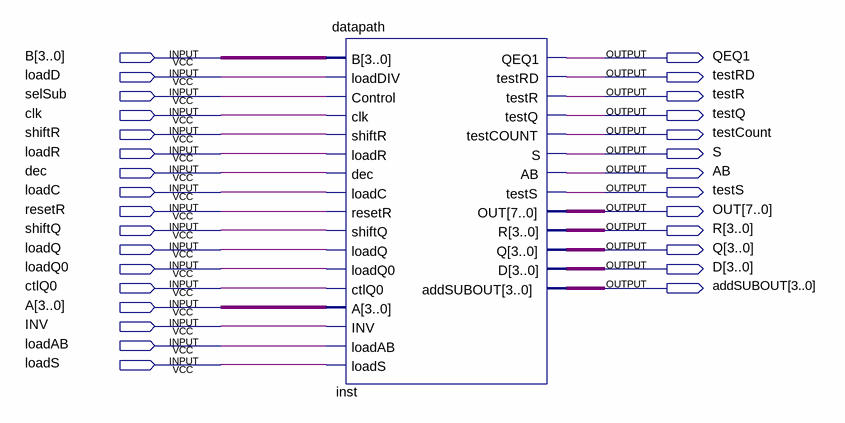
[diagram p0: schematic sheet]
// Quartus schematic lab2testDATAPATH.bdf as structural Verilog: 1 symbols, 30 pins
module lab2testDATAPATH (
  input  [3:0] B,
  input  loadD,
  input  selSub,
  input  clk,
  input  shiftR,
  input  loadR,
  input  dec,
  input  loadC,
  input  resetR,
  input  shiftQ,
  input  loadQ,
  input  loadQ0,
  input  ctlQ0,
  input  [3:0] A,
  input  INV,
  input  loadAB,
  input  loadS,
  output QEQ1,
  output testRD,
  output testR,
  output testQ,
  output testCount,
  output S,
  output AB,
  output testS,
  output [7:0] OUT,
  output [3:0] R,
  output [3:0] Q,
  output [3:0] D,
  output [3:0] addSUBOUT
);

  datapath inst (
    .B(B), .loadDIV(loadD), .Control(selSub), .clk(clk), .shiftR(shiftR), .loadR(loadR), .dec(dec),
    .loadC(loadC), .resetR(resetR), .shiftQ(shiftQ), .loadQ(loadQ), .loadQ0(loadQ0), .ctlQ0(ctlQ0), .A(A),
    .INV(INV), .loadAB(loadAB), .loadS(loadS), .QEQ1(QEQ1), .testRD(testRD), .testR(testR), .testQ(testQ),
    .testCOUNT(testCount), .S(S), .AB(AB), .testS(testS), .OUT(OUT), .R(R), .Q(Q), .D(D),
    .addSUBOUT(addSUBOUT));
endmodule
